# Altium schematic sheet Moo_it.SchDoc
size A; SheetNumber: 1; SheetTotal: 1
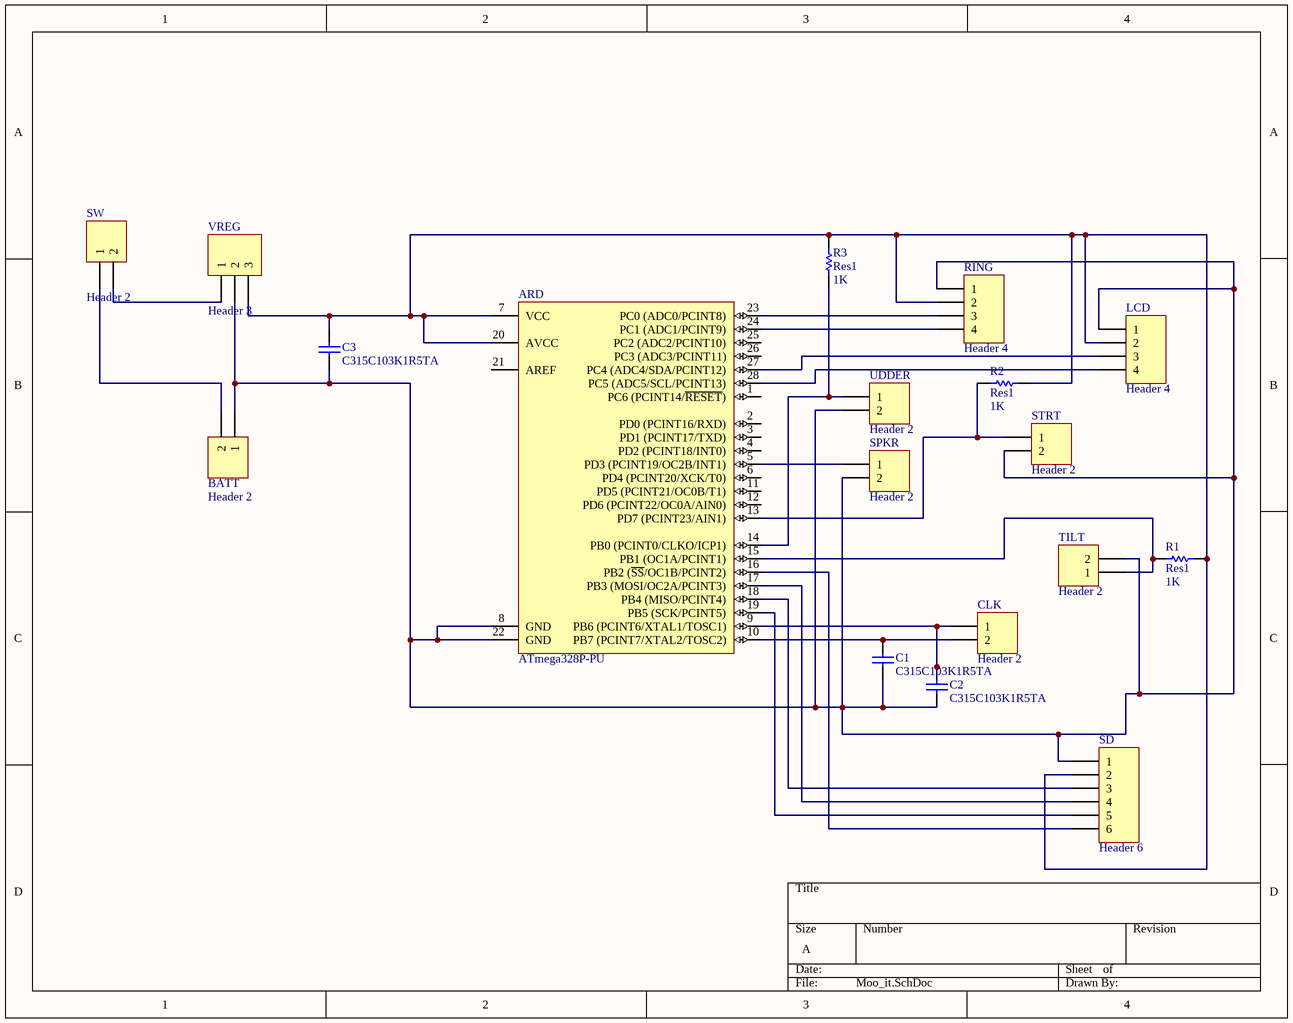
[diagram p0: Moo_it.SchDoc]

## Parts
ARD  ATmega328P-PU  [28P3]
BATT  Header 2  [HDR1X2]
C1  C315C103K1R5TA  [KEMT-C315-THT-2]
C2  C315C103K1R5TA  [KEMT-C315-THT-2]
C3  C315C103K1R5TA  [KEMT-C315-THT-2]
CLK  Header 2  [HDR1X2]
LCD  Header 4  [HDR1X4]
R1  Res1  value 1K  [AXIAL-0.3]
R2  Res1  value 1K  [AXIAL-0.3]
R3  Res1  value 1K  [AXIAL-0.3]
RING  Header 4  [HDR1X4]
SD  Header 6  [HDR1X6]
SPKR  Header 2  [HDR1X2]
STRT  Header 2  [HDR1X2]
SW  Header 2  [HDR1X2]
TILT  Header 2  [HDR1X2]
UDDER  Header 2  [HDR1X2]
VREG  Header 3  [HDR1X3]

## Nets
NetARD_5: ARD.5(PD3_(PCINT19/OC2B/INT1)) SPKR.1
NetARD_7: ARD.7(VCC) ARD.20(AVCC) C3.2 LCD.2 R1.2 R2.2 R3.2 RING.2 SD.2 VREG.3
NetARD_8: ARD.8(GND) ARD.22(GND) BATT.1 C1.1 C2.1 C3.1 LCD.1 RING.1 SD.1 SPKR.2 STRT.2 TILT.2 UDDER.2 VREG.2
NetARD_9: ARD.9(PB6_(PCINT6/XTAL1/TOSC1)) C2.2 CLK.1
NetARD_10: ARD.10(PB7_(PCINT7/XTAL2/TOSC2)) C1.2 CLK.2
NetARD_13: ARD.13(PD7_(PCINT23/AIN1)) R2.1 STRT.1
NetARD_14: ARD.14(PB0_(PCINT0/CLKO/ICP1)) R3.1 UDDER.1
NetARD_15: ARD.15(PB1_(OC1A/PCINT1)) R1.1 TILT.1
NetARD_16: ARD.16(PB2_(~{SS}/OC1B/PCINT2)) SD.6
NetARD_17: ARD.17(PB3_(MOSI/OC2A/PCINT3)) SD.4
NetARD_18: ARD.18(PB4_(MISO/PCINT4)) SD.3
NetARD_19: ARD.19(PB5_(SCK/PCINT5)) SD.5
NetARD_23: ARD.23(PC0_(ADC0/PCINT8)) RING.3
NetARD_24: ARD.24(PC1_(ADC1/PCINT9)) RING.4
NetARD_27: ARD.27(PC4_(ADC4/SDA/PCINT12)) LCD.3
NetARD_28: ARD.28(PC5_(ADC5/SCL/PCINT13)) LCD.4
NetBATT_2: BATT.2 SW.1
NetSW_2: SW.2 VREG.1

Not connected (* = marked no-connect by the designer): ARD 1(PC6_(PCINT14/~{RESET})) 2(PD0_(PCINT16/RXD)) 3(PD1_(PCINT17/TXD)) 4(PD2_(PCINT18/INT0)) 6(PD4_(PCINT20/XCK/T0)) 11(PD5_(PCINT21/OC0B/T1)) 12(PD6_(PCINT22/OC0A/AIN0)) 21(AREF) 25(PC2_(ADC2/PCINT10)) 26(PC3_(ADC3/PCINT11))

## Library data of the parts
ARD = CMP-0095-00013-2: 8-bit AVR Microcontroller, 32KB Flash, 1KB EEPROM, 2KB SRAM, 28-pin PDIP, Industrial Grade (-40°C to 85°C); RevisionNote: DatasheetVersion updated. URLs added.; PackageVersion: revB, Sep-2001; PackageDescription: 28-lead (0.300"/7.62mm Wide) Plastic Dual Inline Package (PDIP); DatasheetVersion: revD, May-2011; ComponentLink1Description: Manufacturer URL; ComponentLink1URL: http://www.atmel.com/; PackageReference: 28P3; ComponentLink2Description: ATmega48A/48PA/88A/88PA/168A/168PA/328/328P Datasheet; ComponentLink3URL: http://www.atmel.com/dyn/resources/prod_documents/8271S.pdf; ComponentLink2URL: http://www.atmel.com/dyn/resources/prod_documents/8271.pdf; ComponentLink3Description: ATmega48A/48PA/88A/88PA/168A/168PA/328/328P Summary
BATT CLK SPKR STRT SW TILT UDDER = Header 2: Header, 2-Pin; LatestRevisionDate: 17-Jul-2002; LatestRevisionNote: Re-released for DXP Platform.; Publisher: Altium Limited
C1-C3 = CMP-1664-00007-1: Capacitor, Ceramic, 0.01 uF, +/- 10%, 100 V, X7R, -55 to 125 degC, 2-Pin THD, RoHS, Bulk; Output Voltage: 70 V; Case\Package: PDIP; Forward Current: 60 mA; Nominal Vf: 1.3 V; Forward Voltage: 1.5 V; Channels: 2; Max Power Dissipation: 400 mW; Vce Max: 500 mV; ComponentLink1Description: Manufacturer URL; ComponentLink2Description: Datasheet; Packaging: Rail/Tube; RoHSCompliant: true; Package Quantity: 2000; PackageReference: C315-THT-2; Min Operating Temperature: -55 degC; Max Operating Temperature: 100 degC; Radiation Hardening: No; ComponentLink1URL: http://www.kemet.com/; DatasheetVersion: Aug-16; Pins: 16; PackageDescription: 2-Pin Through Hole Device, Body 3.81 x 2.54 mm; REACH SVHC: Unknown; Mount: Through Hole; ComponentLink2URL: http://capacitoredge.kemet.com/capedge2/DataSheet/Datasheet-C315C103K1R5TA.pdf?pn=C315C103K1R5TA{BULK}
LCD RING = Header 4: Header, 4-Pin; LatestRevisionDate: 17-Jul-2002; LatestRevisionNote: Re-released for DXP Platform.; Publisher: Altium Limited
R1-R3 = Res1: Resistor; Published: 8-Jun-2000; LatestRevisionDate: 17-Jul-2002; LatestRevisionNote: Re-released for DXP Platform.; PackageReference: AXIAL-0.3; Publisher: Altium Limited; PackageDescription: Axial Device, Thru-Hole; 2 Leads; 0.3 in Pin Spacing
SD = Header 6: Header, 6-Pin; LatestRevisionDate: 17-Jul-2002; LatestRevisionNote: Re-released for DXP Platform.; Publisher: Altium Limited
VREG = Header 3: Header, 3-Pin; LatestRevisionDate: 17-Jul-2002; LatestRevisionNote: Re-released for DXP Platform.; Publisher: Altium Limited